# Altium project TourniquetPCBV1.PrjPcb (part 1 of 3)
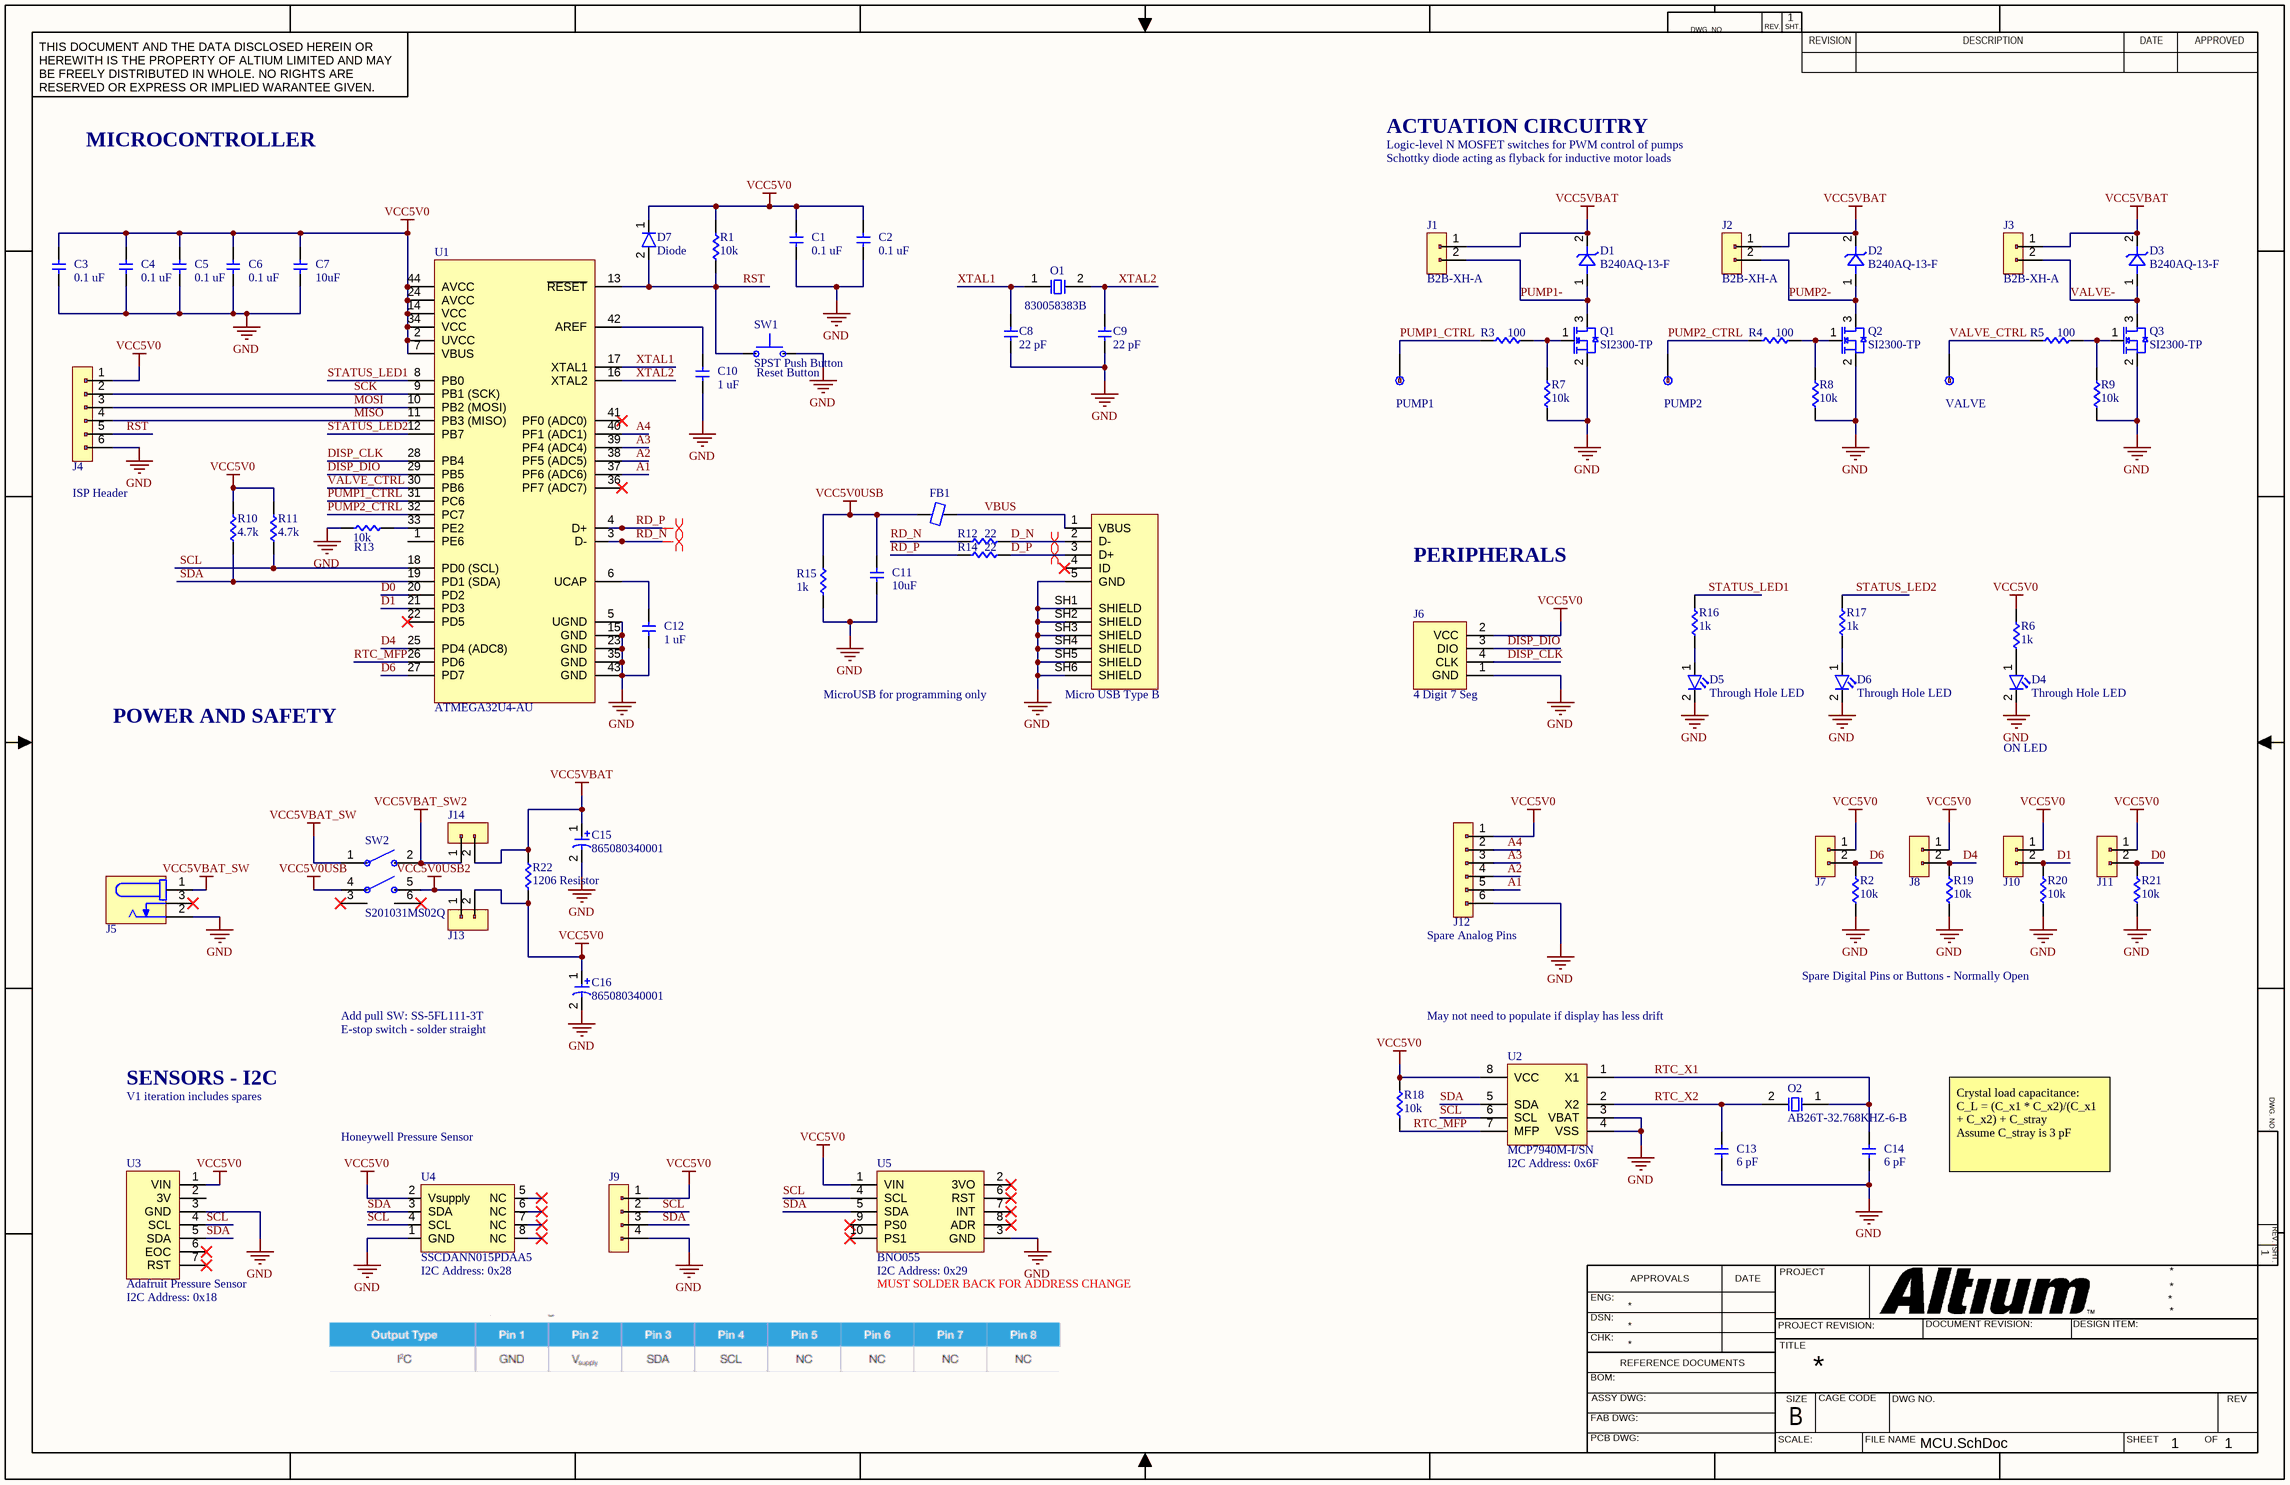
[diagram p0: MCU.SchDoc]
1 sheet, 76 parts. Net scope: global (net labels, ports and power ports of the same name join across sheets).
Board file: TourniquetPCBV1.PcbDoc

## Sheet MCU.SchDoc
size 431 x 279 mm; SheetNumber: 1; SheetTotal: 1

### Parts
*  Micro USB Type B  [10118194-0001LF]
C1  0.1 uF  [0603_CAP]
C2  0.1 uF  [0603_CAP]
C3  0.1 uF  [0603_CAP]
C4  0.1 uF  [0603_CAP]
C5  0.1 uF  [0603_CAP]
C6  0.1 uF  [0603_CAP]
C7  10uF  [0603_CAP]
C8  22 pF  [0603_CAP]
C9  22 pF  [0603_CAP]
C10  1 uF  [0603_CAP]
C11  10uF  [0603_CAP]
C12  1 uF  [0603_CAP]
C13  6 pF  [0603_CAP]
C14  6 pF  [0603_CAP]
C15  865080340001  [865080340001]
C16  865080340001  [865080340001]
D1  B240AQ-13-F  [SMA]
D2  B240AQ-13-F  [SMA]
D3  B240AQ-13-F  [SMA]
D4  Through Hole LED  [RED LED]
D5  Through Hole LED  [RED LED]
D6  Through Hole LED  [RED LED]
D7  Diode  [Diode]
FB1  Ferrite Bead 732-1591-2-ND  [Ferrite Bead]  (value not drawn)
J1  B2B-XH-A  [B2B-XH]
J2  B2B-XH-A  [B2B-XH]
J3  B2B-XH-A  [B2B-XH]
J4  6PIN_HEADER  [6_pin_2.54mm]  (value not drawn)
J5  0878310641  [54-00166]  (value not drawn)
J6  4 Digit 7 Seg  [B4B-XH]
J7  0878310641  [2PIN_2.54mm]  (value not drawn)
J8  0878310641  [2PIN_2.54mm]  (value not drawn)
J9  4PIN_HEADER  [4PIN_2.54mm]  (value not drawn)
J10  0878310641  [2PIN_2.54mm]  (value not drawn)
J11  0878310641  [2PIN_2.54mm]  (value not drawn)
J12  6PIN_HEADER  [6_pin_2.54mm]  (value not drawn)
J13  0878310641  [2PIN_2.54mm]  (value not drawn)
J14  0878310641  [2PIN_2.54mm]  (value not drawn)
O1  830058383B  [830058383B]
O2  AB26T-32.768KHZ-6-B  [XTAL_AB26T-32.768KHZ-6-B]
PUMP1  1PIN_HEADER_TEST  [1PIN_2.54mm]  (value not drawn)
PUMP2  1PIN_HEADER_TEST  [1PIN_2.54mm]  (value not drawn)
Q1  SI2300-TP  [SOT23]
Q2  SI2300-TP  [SOT23]
Q3  SI2300-TP  [SOT23]
R1  10k  [0603_RES]
R2  10k  [0603_RES]
R3  100  [0603_RES]
R4  100  [0603_RES]
R5  100  [0603_RES]
R6  1k  [0603_RES]
R7  10k  [0603_RES]
R8  10k  [0603_RES]
R9  10k  [0603_RES]
R10  4.7k  [0603_RES]
R11  4.7k  [0603_RES]
R12  22  [0603_RES]
R13  10k  [0603_RES]
R14  22  [0603_RES]
R15  1k  [0603_RES]
R16  1k  [0603_RES]
R17  1k  [0603_RES]
R18  10k  [0603_RES]
R19  10k  [0603_RES]
R20  10k  [0603_RES]
R21  10k  [0603_RES]
R22  1206 Resistor  [1206 Resistor]
SW1  SPST Push Button  [Push Button]
SW2  S201031MS02Q  [DPST Sliding Switch]
U1  ATMEGA32U4-AU  [ATMEGA32U4-AU]
U2  MCP7940M-I/SN  [8SOIC]
U3  Adafruit Pressure Sensor  [Adafruit Pressure Sensor]
U4  SSCDANN015PDAA5  [SSCDANN015PDAA5]
U5  BNO055  [BNO055]
VALVE  1PIN_HEADER_TEST  [1PIN_2.54mm]  (value not drawn)

### Nets
GND: *.5(GND) *.SH1(SHIELD) *.SH2(SHIELD) *.SH3(SHIELD) *.SH4(SHIELD) *.SH5(SHIELD) *.SH6(SHIELD) C1.2 C2.2 C3.2 C4.2 C5.2 C6.2 C7.2 C8.1 C9.1 C10.2 C11.2 C12.2 C13.2 C14.2 C15.2(NEG) C16.2(NEG) D4.2(Cathode) D5.2(Cathode) D6.2(Cathode) J4.6 J5.2(B) J6.1(GND) J9.4 J12.6 Q1.2(S) Q2.2(S) Q3.2(S) R2.2 R7.2 R8.2 R9.2 R13.1 R15.1 R19.2 R20.2 R21.2 SW1.2 U1.5(UGND) U1.15(GND) U1.23(GND) U1.35(GND) U1.43(GND) U2.3(VBAT) U2.4(VSS) U3.3(GND) U4.1(GND) U5.3(GND)
VCC5V0: C1.1 C2.1 C3.1 C4.1 C5.1 C6.1 C7.1 C16.1(POS) D7.1(Cathode) J4.1(SCL) J6.2(VCC) J7.1(SCL) J8.1(SCL) J9.1(SCL) J10.1(SCL) J11.1(SCL) J12.1(SCL) J13.2 R1.1 R6.1 R10.1 R11.1 R18.2 R22.1 U1.2(UVCC) U1.7(VBUS) U1.14(VCC) U1.24(AVCC) U1.34(VCC) U1.44(AVCC) U2.8(VCC) U3.1(VIN) U4.2(Vsupply) U5.1(VIN)
VCC5V0USB: C11.1 FB1.1 R15.2 SW2.4(NC2)
VCC5V0USB2: J13.1(SCL) SW2.5(COM2)
VCC5VBAT: C15.1(POS) D1.2(K) D2.2(K) D3.2(K) J1.1(SCL) J2.1(SCL) J3.1(SCL) J14.2(SCL) R22.2
VCC5VBAT_SW: J5.1(A) SW2.1(NC1)
VCC5VBAT_SW2: J14.1 SW2.2(COM1)
A1: J12.5 U1.37(PF6_(ADC6))
A2: J12.4 U1.38(PF5_(ADC5))
A3: J12.3 U1.39(PF4_(ADC4))
A4: J12.2 U1.40(PF1_(ADC1))
D0: J11.2 R21.1 U1.20(PD2)
D1: J10.2 R20.1 U1.21(PD3)
D4: J8.2 R19.1 U1.25(PD4_(ADC8))
D6: J7.2 R2.1 U1.27(PD7)
D_N: *.2(D-) R12.2
D_P: *.3(D+) R14.2
DISP_CLK: J6.4(CLK) U1.28(PB4)
DISP_DIO: J6.3(DIO) U1.29(PB5)
MISO: J4.4 U1.11(PB3_(MISO))
MOSI: J4.3 U1.10(PB2_(MOSI))
PUMP1-: D1.1(A) J1.2 Q1.3(D)
PUMP1_CTRL: PUMP1.1 R3.1 U1.31(PC6)
PUMP2-: D2.1(A) J2.2 Q2.3(D)
PUMP2_CTRL: PUMP2.1 R4.1 U1.32(PC7)
RD_N: R12.1 U1.3(D-)
RD_P: R14.1 U1.4(D+)
RST: D7.2(Anode) J4.5 R1.2 SW1.1 U1.13(~{RESET})
RTC_MFP: R18.1 U1.26(PD6) U2.7(MFP)
RTC_X1: C14.1 O2.1(XTAL1) U2.1(X1)
RTC_X2: C13.1 O2.2(GND) U2.2(X2)
SCK: J4.2 U1.9(PB1_(SCK))
SCL: J9.2 R11.2 U1.18(PD0_(SCL)) U2.6(SCL) U3.4(SCL) U4.4(SCL) U5.4(SCL)
SDA: J9.3 R10.2 U1.19(PD1_(SDA)) U2.5(SDA) U3.5(SDA) U4.3(SDA) U5.5(SDA)
STATUS_LED1: R16.1 U1.8(PB0)
STATUS_LED2: R17.1 U1.12(PB7)
VALVE-: D3.1(A) J3.2 Q3.3(D)
VALVE_CTRL: R5.1 U1.30(PB6) VALVE.1
VBUS: *.1(VBUS) FB1.2
XTAL1: C8.2 O1.1(XTAL1) U1.17(XTAL1)
XTAL2: C9.2 O1.2(GND) U1.16(XTAL2)
NetC10_1: C10.1 U1.42(AREF)
NetC12_1: C12.1 U1.6(UCAP)
NetD4_1: D4.1(Anode) R6.2
NetD5_1: D5.1(Anode) R16.2
NetD6_1: D6.1(Anode) R17.2
NetQ1_1: Q1.1(G) R3.2 R7.1
NetQ2_1: Q2.1(G) R4.2 R8.1
NetQ3_1: Q3.1(G) R5.2 R9.1
NetR13_2: R13.2 U1.33(PE2)

Not connected (* = marked no-connect by the designer): * 4(ID)*; J5 3(C)*; SW2 3(NC2)* 6(NC2)*; U1 1(PE6) 22(PD5)* 36(PF7_(ADC7))* 41(PF0_(ADC0))*; U3 2(3V) 6(EOC)* 7(RST)*; U4 5(NC)* 6(NC)* 7(NC)* 8(NC)*; U5 2(3VO)* 6(RST)* 7(INT)* 8(ADR)* 9(PS0)* 10(PS1)*

### Layout directives
differential pair: D_N, D_P, RD_N, RD_P

### Notes on the sheet
- MICROCONTROLLER
- ACTUATION CIRCUITRY
- Logic-level N MOSFET switches for PWM control of pumps
- Schottky diode acting as flyback for inductive motor loads
- (near SW1) Reset Button
- (near J4) ISP Header
- PERIPHERALS
- MicroUSB for programming only
- POWER AND SAFETY
- ON LED
- (near J12) Spare Analog Pins
- Add pull SW: SS-5FL111-3T
- E-stop switch - solder straight
- May not need to populate if display has less drift
- Spare Digital Pins or Buttons - Normally Open
- SENSORS - I2C
- V1 iteration includes spares
- Honeywell Pressure Sensor
- (near U2) I2C Address: 0x6F
- Crystal load capacitance:
  C_L = (C_x1 * C_x2)/(C_x1 + C_x2) + C_stray
  Assume C_stray is 3 pF
- (near U3) I2C Address: 0x18
- (near U4) I2C Address: 0x28
- (near U5) I2C Address: 0x29
- (near U5) MUST SOLDER BACK FOR ADDRESS CHANGE
- DWG. NO.
- REV.
- SHT.
- THIS DOCUMENT AND THE DATA DISCLOSED HEREIN OR HEREWITH IS THE PROPERTY OF ALTIUM LIMITED AND MAY BE FREELY DISTRIBUTED IN WHOLE. NO RIGHTS ARE RESERVED OR EXPRESS OR IMPLIED WARANTEE GIVEN.
- REVISION
- DESCRIPTION
- DATE
- APPROVED
- ENG:
- APPROVALS
- PROJECT
- DSN:
- CHK:
- REFERENCE DOCUMENTS
- PROJECT REVISION:
- TITLE
- DOCUMENT REVISION:
- DESIGN ITEM:
- BOM:
- FAB DWG:
- PCB DWG:
- ASSY DWG:
- SCALE:
- SIZE
- B
- CAGE CODE
- FILE NAME
- DWG NO.
- SHEET
- OF
- REV